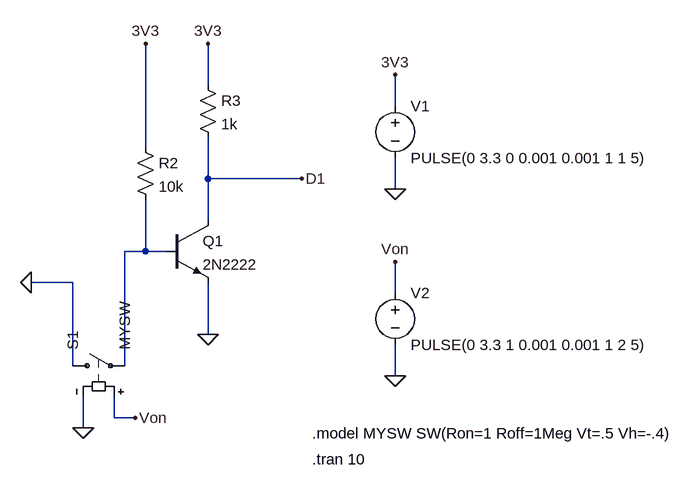
[diagram p0: schematic levelSense.asc]
levelSense.asc, the LTspice schematic file:
Version 4
SHEET 1 1288 680
WIRE 528 -368 528 -432
WIRE 816 -336 816 -384
WIRE 432 -272 432 -432
WIRE 528 -224 528 -288
WIRE 672 -224 528 -224
WIRE 816 -208 816 -256
WIRE 528 -160 528 -224
WIRE 432 -112 432 -192
WIRE 432 -112 400 -112
WIRE 464 -112 432 -112
WIRE 320 -64 256 -64
WIRE 816 -48 816 -96
WIRE 528 16 528 -64
WIRE 320 64 320 -64
WIRE 400 64 400 -112
WIRE 816 80 816 32
WIRE 384 144 384 112
WIRE 416 144 384 144
WIRE 336 160 336 112
FLAG 256 -64 0
FLAG 432 -432 3V3
FLAG 528 -432 3V3
FLAG 528 16 0
FLAG 672 -224 D1
FLAG 336 160 0
FLAG 416 144 Von
FLAG 816 80 0
FLAG 816 -208 0
FLAG 816 -96 Von
FLAG 816 -384 3V3
SYMBOL npn 464 -160 R0
SYMATTR InstName Q1
SYMATTR Value 2N2222
SYMBOL res 416 -288 R0
SYMATTR InstName R2
SYMATTR Value 10k
SYMBOL res 512 -384 R0
SYMATTR InstName R3
SYMATTR Value 1k
SYMBOL sw 304 64 R270
SYMATTR InstName S1
SYMATTR Value MYSW
SYMBOL voltage 816 -352 R0
WINDOW 123 0 0 Left 0
WINDOW 39 0 0 Left 0
SYMATTR InstName V1
SYMATTR Value PULSE(0 3.3 0 0.001 0.001 1 1 5)
SYMBOL voltage 816 -64 R0
WINDOW 123 0 0 Left 0
WINDOW 39 0 0 Left 0
SYMATTR InstName V2
SYMATTR Value PULSE(0 3.3 1 0.001 0.001 1 2 5)
TEXT 688 208 Left 2 !.tran 10
TEXT 688 168 Left 2 !.model MYSW SW(Ron=1 Roff=1Meg Vt=.5 Vh=-.4)

The netlist it stands for:
* levelSense.asc
Q1 D1 N001 0 0 2N2222
R2 3V3 N001 10k
R3 3V3 D1 1k
S1 0 N001 Von 0 MYSW
V1 3V3 0 PULSE(0 3.3 0 0.001 0.001 1 1 5)
V2 Von 0 PULSE(0 3.3 1 0.001 0.001 1 2 5)
.model NPN NPN
.model PNP PNP
.lib standard.bjt
.tran 10
.model MYSW SW(Ron=1 Roff=1Meg Vt=.5 Vh=-.4)
.backanno
.end

* Results of the author's LTspice run, read from the files saved beside the schematic
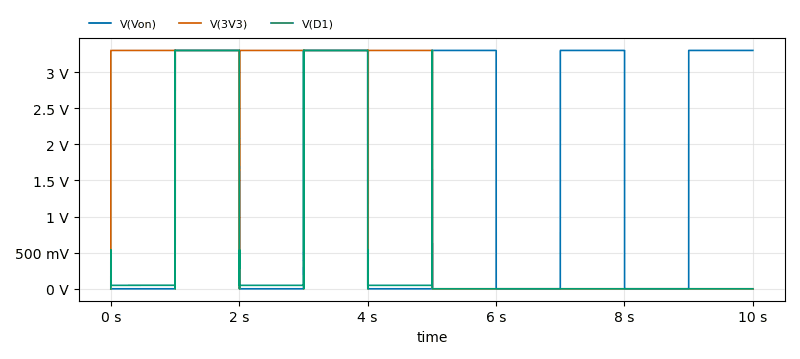
[diagram p1: Transient Analysis of levelSense.asc, plotted from the saved traces]
* Transient Analysis, 1 run:
*   V(Von): min 0 V, max 3.3 V, average 1.651 V, rms 2.334 V, last 3.3 V
*   V(3V3): min 0 V, max 3.3 V, average 1.652 V, rms 2.334 V, last 0 V
*   V(D1): min -67.87 µV, max 3.301 V, average 678 mV, rms 1.48 V, last 0 V